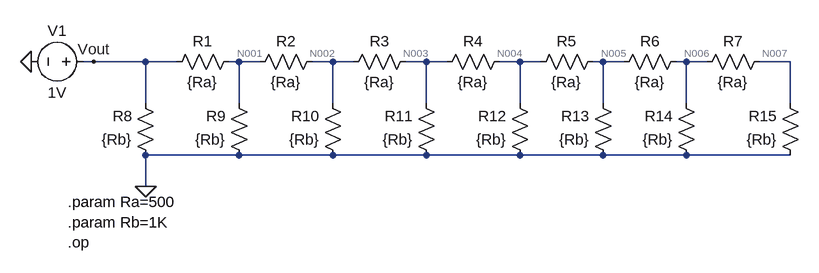
[diagram p0: schematic 3-6_8-bit-R-2R-ladder.asc]
3-6_8-bit-R-2R-ladder.asc, the LTspice schematic file:
Version 4.1
SHEET 1 1108 680
WIRE 16 -80 0 -80
WIRE 96 -80 16 -80
WIRE 144 -80 96 -80
WIRE 240 -80 224 -80
WIRE 272 -80 240 -80
WIRE 384 -80 352 -80
WIRE 416 -80 384 -80
WIRE 528 -80 496 -80
WIRE 560 -80 528 -80
WIRE 672 -80 640 -80
WIRE 704 -80 672 -80
WIRE 800 -80 784 -80
WIRE 832 -80 800 -80
WIRE 928 -80 912 -80
WIRE 960 -80 928 -80
WIRE 1088 -80 1040 -80
WIRE 96 -16 96 -80
WIRE 240 -16 240 -80
WIRE 384 -16 384 -80
WIRE 528 -16 528 -80
WIRE 672 -16 672 -80
WIRE 800 -16 800 -80
WIRE 928 -16 928 -80
WIRE 1088 -16 1088 -80
WIRE 240 64 96 64
WIRE 384 64 240 64
WIRE 528 64 384 64
WIRE 672 64 528 64
WIRE 800 64 672 64
WIRE 928 64 800 64
WIRE 1088 64 928 64
WIRE 96 112 96 64
FLAG 96 112 0
FLAG 16 -80 Vout
FLAG -80 -80 0
SYMBOL res 240 -96 R90
WINDOW 0 0 56 VBottom 2
WINDOW 3 32 56 VTop 2
SYMATTR InstName R1
SYMATTR Value {Ra}
SYMBOL res 368 -96 R90
WINDOW 0 0 56 VBottom 2
WINDOW 3 32 56 VTop 2
SYMATTR InstName R2
SYMATTR Value {Ra}
SYMBOL res 512 -96 R90
WINDOW 0 0 56 VBottom 2
WINDOW 3 32 56 VTop 2
SYMATTR InstName R3
SYMATTR Value {Ra}
SYMBOL res 656 -96 R90
WINDOW 0 0 56 VBottom 2
WINDOW 3 32 56 VTop 2
SYMATTR InstName R4
SYMATTR Value {Ra}
SYMBOL res 800 -96 R90
WINDOW 0 0 56 VBottom 2
WINDOW 3 32 56 VTop 2
SYMATTR InstName R5
SYMATTR Value {Ra}
SYMBOL res 928 -96 R90
WINDOW 0 0 56 VBottom 2
WINDOW 3 32 56 VTop 2
SYMATTR InstName R6
SYMATTR Value {Ra}
SYMBOL res 1056 -96 R90
WINDOW 0 0 56 VBottom 2
WINDOW 3 32 56 VTop 2
SYMATTR InstName R7
SYMATTR Value {Ra}
SYMBOL res 112 80 R180
WINDOW 0 36 76 Left 2
WINDOW 3 36 40 Left 2
SYMATTR InstName R8
SYMATTR Value {Rb}
SYMBOL res 256 80 R180
WINDOW 0 36 76 Left 2
WINDOW 3 36 40 Left 2
SYMATTR InstName R9
SYMATTR Value {Rb}
SYMBOL res 400 80 R180
WINDOW 0 36 76 Left 2
WINDOW 3 36 40 Left 2
SYMATTR InstName R10
SYMATTR Value {Rb}
SYMBOL res 544 80 R180
WINDOW 0 36 76 Left 2
WINDOW 3 36 40 Left 2
SYMATTR InstName R11
SYMATTR Value {Rb}
SYMBOL res 688 80 R180
WINDOW 0 36 76 Left 2
WINDOW 3 36 40 Left 2
SYMATTR InstName R12
SYMATTR Value {Rb}
SYMBOL res 816 80 R180
WINDOW 0 36 76 Left 2
WINDOW 3 36 40 Left 2
SYMATTR InstName R13
SYMATTR Value {Rb}
SYMBOL res 944 80 R180
WINDOW 0 36 76 Left 2
WINDOW 3 36 40 Left 2
SYMATTR InstName R14
SYMATTR Value {Rb}
SYMBOL res 1104 80 R180
WINDOW 0 36 76 Left 2
WINDOW 3 36 40 Left 2
SYMATTR InstName R15
SYMATTR Value {Rb}
SYMBOL voltage 16 -80 R90
WINDOW 0 -32 56 VBottom 2
WINDOW 3 32 56 VTop 2
WINDOW 123 0 0 Left 0
WINDOW 39 0 0 Left 0
SYMATTR InstName V1
SYMATTR Value 1V
TEXT -24 136 Left 2 !.param Ra=500\n.param Rb=1K\n.op

The netlist it stands for:
* 3-6_8-bit-R-2R-ladder.asc
R1 N001 Vout {Ra}
R2 N002 N001 {Ra}
R3 N003 N002 {Ra}
R4 N004 N003 {Ra}
R5 N005 N004 {Ra}
R6 N006 N005 {Ra}
R7 N007 N006 {Ra}
R8 0 Vout {Rb}
R9 0 N001 {Rb}
R10 0 N002 {Rb}
R11 0 N003 {Rb}
R12 0 N004 {Rb}
R13 0 N005 {Rb}
R14 0 N006 {Rb}
R15 0 N007 {Rb}
V1 Vout 0 1V
.param Ra=500
.param Rb=1K
.op
.backanno
.end

* Results of the author's LTspice run, read from the files saved beside the schematic
* Operating Point:
*   V(n001) = 500 mV
*   V(n002) = 250.1 mV
*   V(n003) = 125.2 mV
*   V(n004) = 62.99 mV
*   V(n005) = 32.23 mV
*   V(n006) = 17.58 mV
*   V(n007) = 11.72 mV
*   V(vout) = 1 V
*   I(R1) = -999.9 µA
*   I(R10) = -250.1 µA
*   I(R11) = -125.2 µA
*   I(R12) = -62.99 µA
*   I(R13) = -32.23 µA
*   I(R14) = -17.58 µA
*   I(R15) = -11.72 µA
*   I(R2) = -499.9 µA
*   I(R3) = -249.7 µA
*   I(R4) = -124.5 µA
*   I(R5) = -61.52 µA
*   I(R6) = -29.3 µA
*   I(R7) = -11.72 µA
*   I(R8) = -1 mA
*   I(R9) = -500 µA
*   I(V1) = -2 mA